# EasyEDA schematic ecoluz_scheme.json
TITLE: EcoLuz; REV: 1.0; Date: 2021-05-16; Sheet: 1/1; Drawn By: Jonathas Amaral; Company: Guilda Maker
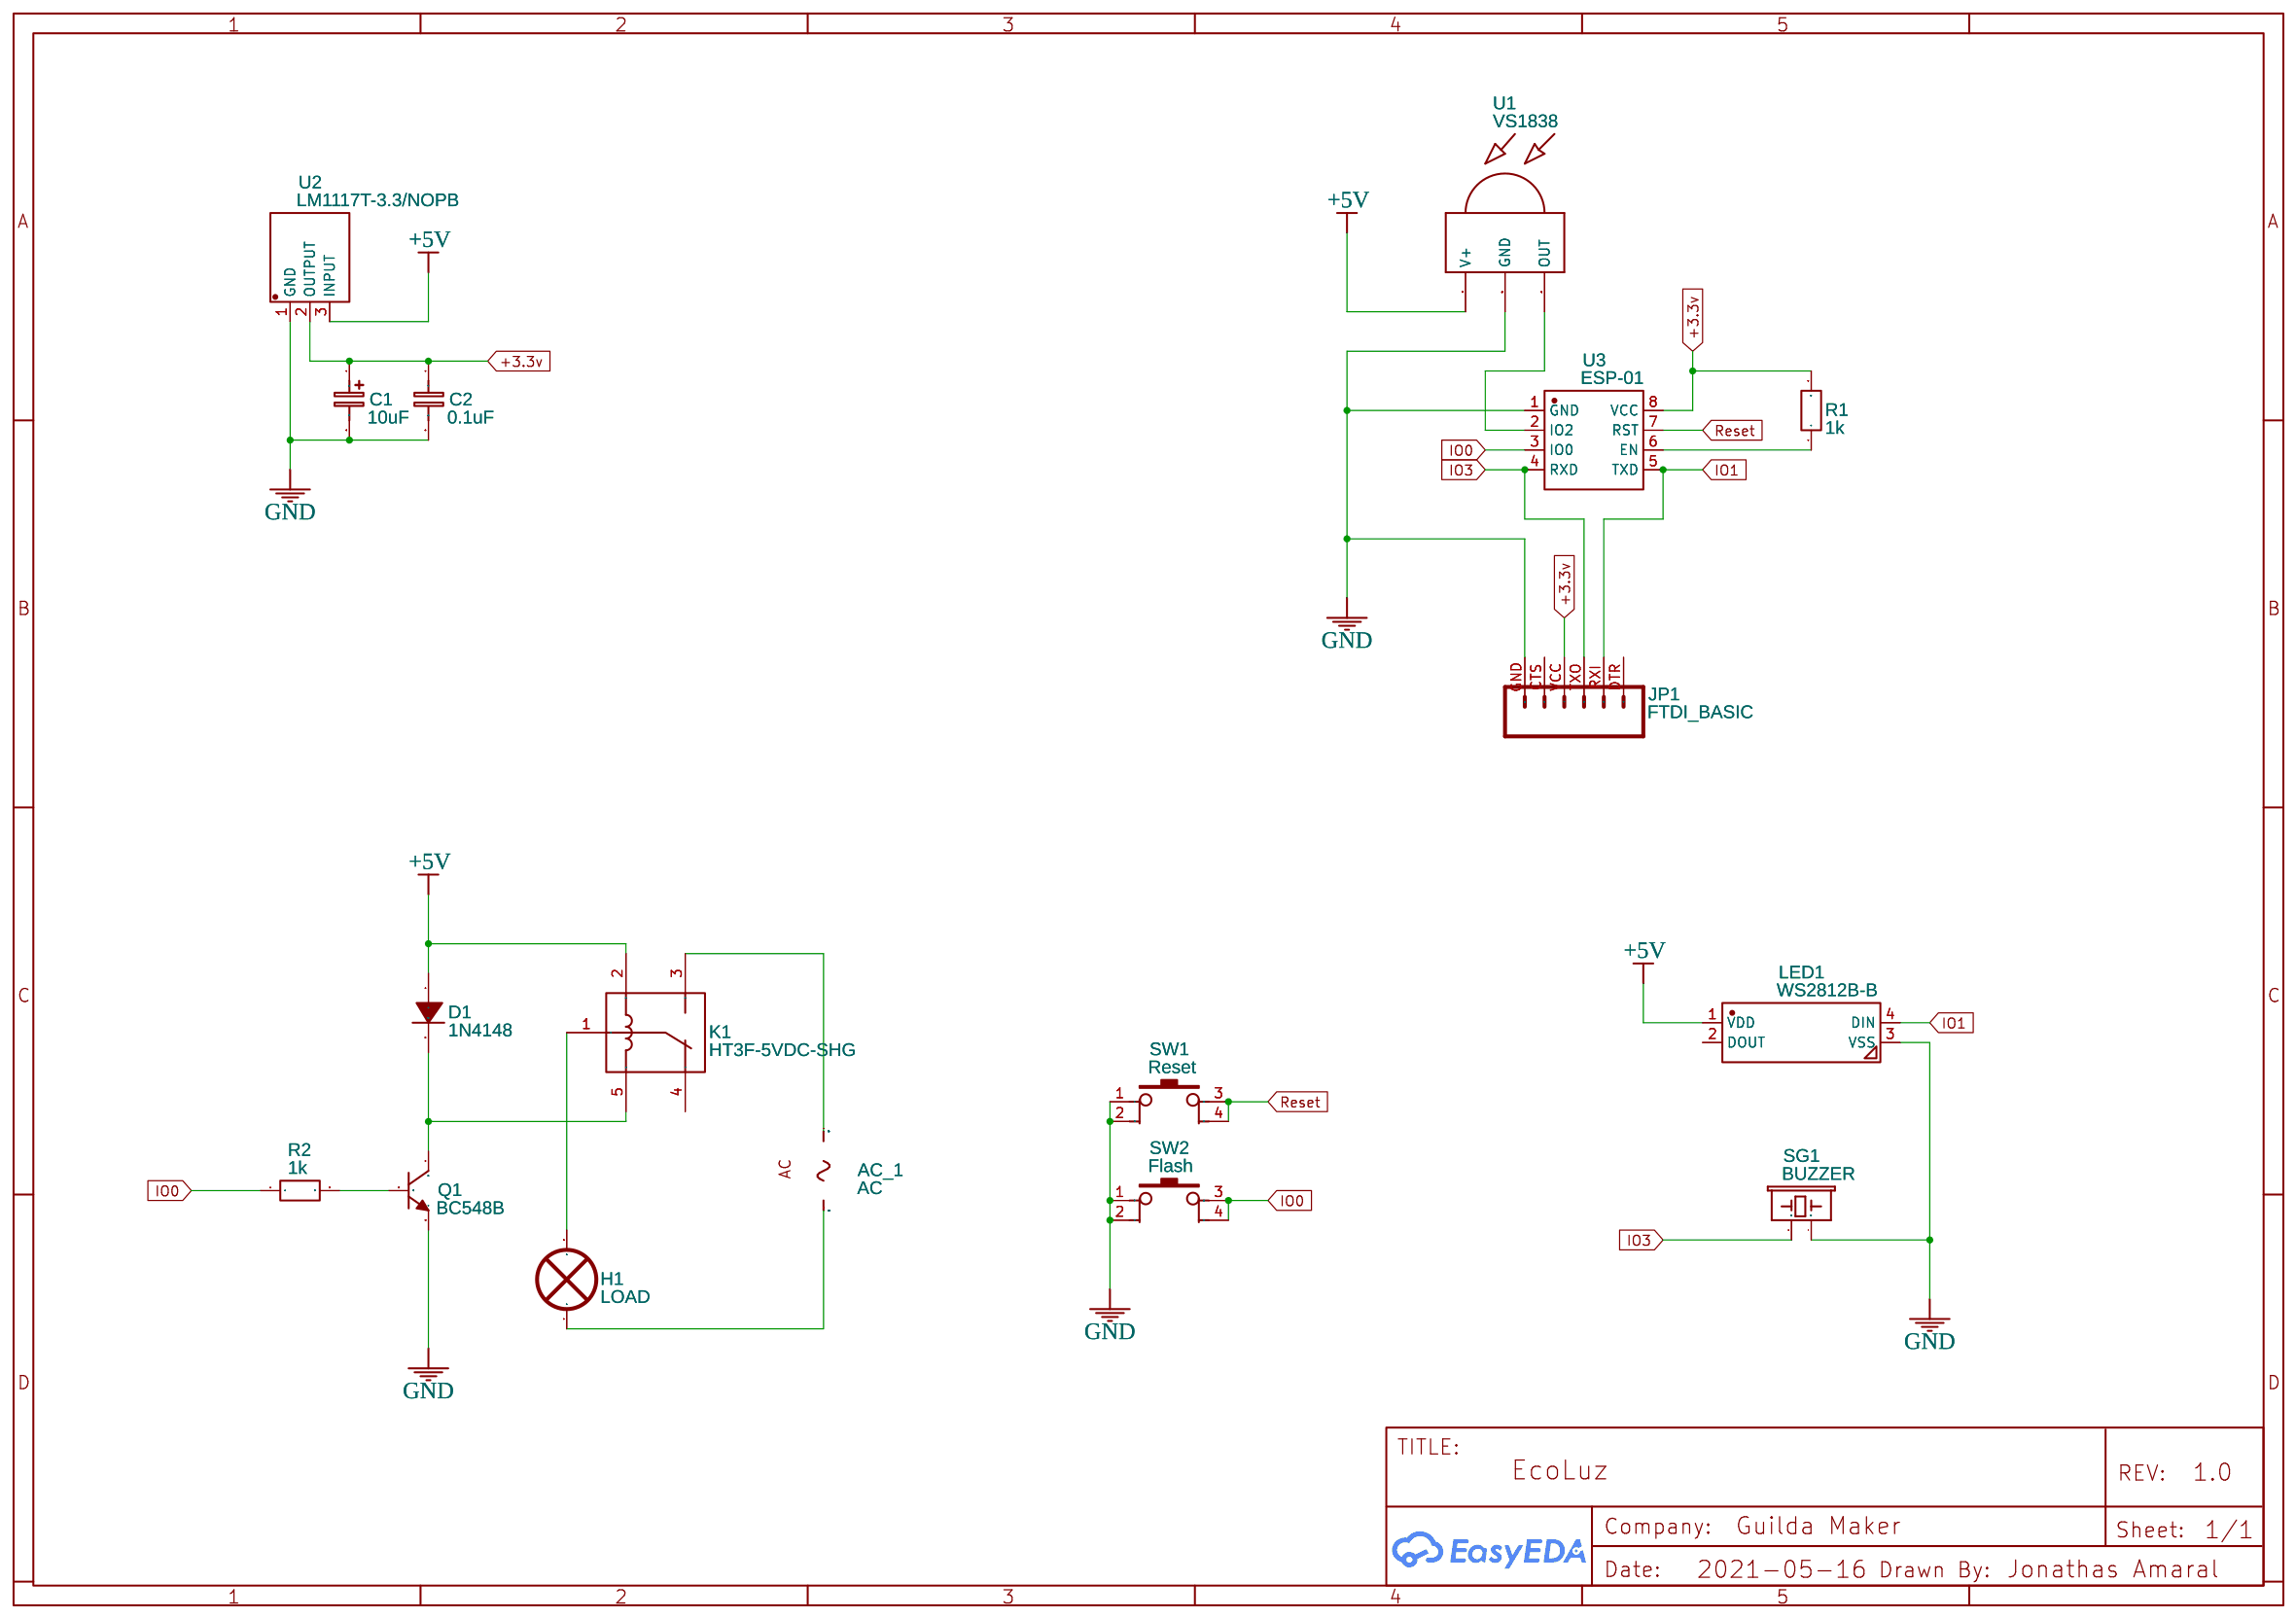
[diagram p0: schematic sheet]

## Parts
AC_1  AC  [AC]
C1  10uF  [CASE-A_3216]
C2  0.1uF  [RAD-0.1]
D1  1N4148  [DO-35_BD2.0-L4.0-P8.00-D0.5-FD]
H1  LOAD  [IND2-N10]
JP1  FTDI_BASIC  [FTDI_BASIC]
K1  HT3F-5VDC-SHG  [RELAY-TH_HT3F-DCXX-X-X]
LED1  WS2812B-B  [LED-SMD_4P-L5.0-W5.0-TL_WS2812B-B]
Q1  BC548B  [TO-92-3_L4.9-W3.7-P1.27-L]
R1  1k  [R0603]
R2  1k  [R0603]
SG1  BUZZER  [BUZZER-CCV-KIT]
SW1  Reset  [SW-SMD_4P-L6.0-W6.0-P4.50-LS8.5]
SW2  Flash  [SW-SMD_4P-L6.0-W6.0-P4.50-LS8.5]
U1  VS1838  [TSOP18XX]
U2  LM1117T-3.3/NOPB  [TO-220-3_L10.0-W4.5-P2.54-L]
U3  ESP-01  [WIFIM-TH_8P-L24.7-W14.4-P2.54]

## Library data of the parts
AC_1 = AC: Contributor: nostradoomus
C1 = C_Tan_SMD_A_EU: Contributor: LCEDA_Lib
C2 = C_RAD-0.1_EU: Contributor: LCEDA_Lib
D1 = 1N4148: Supplier: LCSC; Manufacturer: SEMTECH; image: //image.lceda.cn/szlcsc/C14516.jpg; Supplier Part: C14516; JLCPCB Part Class: Extended Part
H1 = BULB
JP1 = FTDI_BASIC: Contributor: SparkFun
K1 = HT3F-5VDC-SHG: Supplier: LCSC; Manufacturer: HTV; Contributor: LCSC; Supplier Part: C129113
LED1 = WS2812B-B: Supplier: LCSC; Manufacturer: Worldsemi; Contributor: LCSC; Supplier Part: C114586; JLCPCB Part Class: Extended Part
Q1 = BC548B: Supplier: LCSC; Manufacturer: CJ; image: //image.lceda.cn/szlcsc/C36611.jpg; Supplier Part: C36611; JLCPCB Part Class: Extended Part
R1 R2 = R_0603_EU: Contributor: LCEDA_Lib
SG1 = BUZZER: Contributor: SparkFun
SW1 SW2 = Switch-SMD-6x6x11: Supplier Part: C91998; Supplier: LCSC; Manufacturer: BBJ; Manufacturer Part: Switch6*6*11
U1 = VS1838
U2 = LM1117T-3.3/NOPB: Supplier: LCSC; Supplier Part: C201726; Manufacturer: Texas Instruments; Contributor: LCSC; JLCPCB Part Class: Extended Part
U3 = ESP-01: Supplier: LCSC; Supplier Part: C503581; Manufacturer: Ai-Thinker; Contributor: LCSC

## Nets
+3.3v: C1.1 C2.1 JP1.VCC(4) R1.2 U2.2(OUTPUT) U3.8(VCC)
+5V: D1.1(A) K1.2 LED1.1(VDD) U1.VCC(V+) U2.3(INPUT)
GND: C1.2 C2.2 JP1.GND(6) LED1.3(VSS) Q1.3(E) SG1.-(2) SW1.1 SW1.2 SW2.1 SW2.2 U1.GND U2.1(GND) U3.1(GND)
IO0: R2.1 SW2.3 SW2.4 U3.3(IO0)
IO1: JP1.RXI(2) LED1.4(DIN) U3.5(TXD)
IO3: JP1.TXO(3) SG1.+(1) U3.4(RXD)
Reset: SW1.3 SW1.4 U3.7(RST)
Net-(AC_1-A): AC_1.A(ANODE) K1.3
Net-(AC_1-C): AC_1.C(CATHODE) H1.1
Net-(D1-2): D1.2(C) K1.5 Q1.1(C)
Net-(H1-2): H1.2 K1.1
Net-(Q1-2): Q1.2(B) R2.2
Net-(R1-1): R1.1 U3.6(EN)
Net-(U1-OUT): U1.OUT U3.2(IO2)

Not connected (* = marked no-connect by the designer): JP1 CTS(5) DTR(1); K1 4; LED1 2(DOUT)
